# EAGLE design USGlasses (EAGLE 7.6.0)
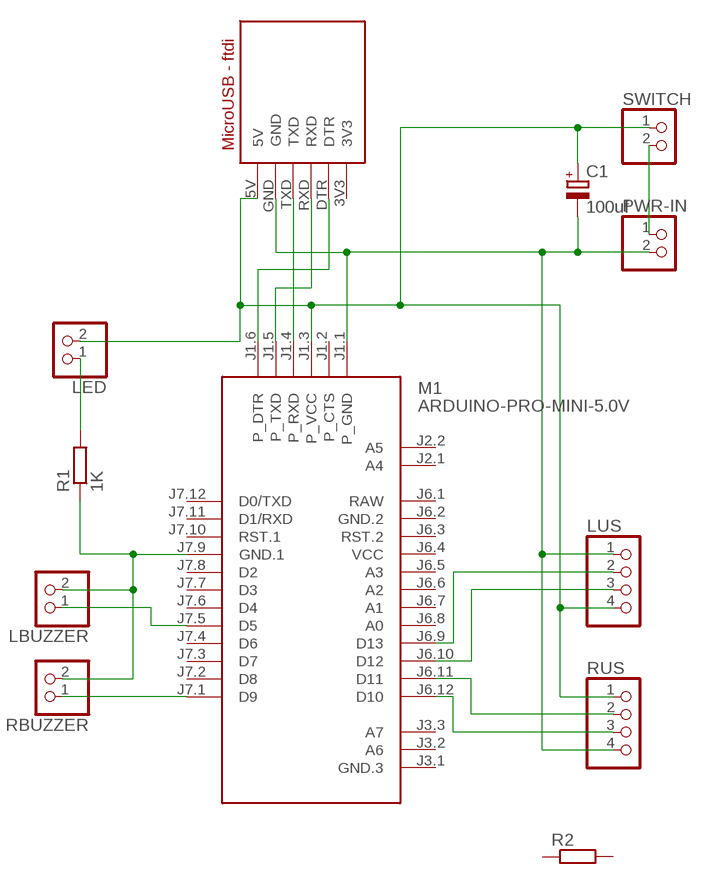
[diagram p0: schematic, sheet 1]

## Parts
C1  100uf  CPOL-EUE2,5-6E  [E2,5-6E]
LBUZZER  PINHD-1X2  [1X02]
LED  PINHD-1X2  [1X02]
LUS  PINHD-1X4  [1X04]
M1  ARDUINO-PRO-MINI-5.0V  [ARDUINO-PRO-MINI]
PWR-IN  PINHD-1X2  [1X02]
R1  1K  R-EU_0204/7  [0204/7]
R2  R-EU_0204/7  [0204/7]
RBUZZER  PINHD-1X2  [1X02]
RUS  PINHD-1X4  [1X04]
SWITCH  PINHD-1X2  [1X02]
U$1  MICRO-USB-DEV  [MICRO-USB-PAC]

## Nets
N$1: M1.J1.4(P_RXD) U$1.TXD
N$2: M1.J1.5(P_TXD) U$1.RXD
N$3: M1.J1.6(P_DTR) U$1.DTR
N$4: LED.1 R1.2
N$6: LUS.3 M1.J6.10(D12)
N$7: PWR-IN.1 SWITCH.2
N$9: C1.+ LED.2 LUS.4 M1.J1.3(P_VCC) RUS.1 SWITCH.1 U$1.5V
N$10: C1.- LUS.1 M1.J1.1(P_GND) PWR-IN.2 RUS.4 U$1.GND
N$11: LUS.2 M1.J6.9(D13)
N$12: M1.J6.11(D11) RUS.2
N$13: M1.J6.12(D10) RUS.3
N$14: LBUZZER.2 M1.J7.9(GND.1) R1.1 RBUZZER.2
N$15: M1.J7.1(D9) RBUZZER.1
N$16: LBUZZER.1 M1.J7.5(D5)
Unconnected: M1.J1.2(P_CTS) M1.J2.1(A4) M1.J2.2(A5) M1.J3.1(GND.3) M1.J3.2(A6) M1.J3.3(A7) M1.J6.3(RST.2) M1.J6.5(A3) M1.J6.6(A2) M1.J6.7(A1) M1.J6.8(A0) M1.J7.2(D8) M1.J7.3(D7) M1.J7.4(D6) M1.J7.6(D4) M1.J7.7(D3) M1.J7.8(D2) M1.J7.10(RST.1) M1.J7.11(D1/RXD) M1.J7.12(D0/TXD) R2.1 R2.2

## Power pins joined to a net without a drawn wire
3V3: U$1.3V3
GND.2: M1.J6.2(GND.2)
RAW: M1.J6.1(RAW)
VCC: M1.J6.4(VCC)

## Library data of the parts
C1 = resistor:CPOL-EU: POLARIZED CAPACITOR, European symbol
LBUZZER LED PWR-IN RBUZZER SWITCH = pinhead:PINHD-1X2: PIN HEADER
LUS RUS = pinhead:PINHD-1X4: PIN HEADER
M1 = diy-modules:ARDUINO-PRO-MINI-*: Arduino Pro Mini
R1 R2 = resistor:R-EU_: RESISTOR, European symbol
U$1 = Dr_Burrows_library:MICRO-USB-DEV: MicroUSB FTDI Programmer

## Board
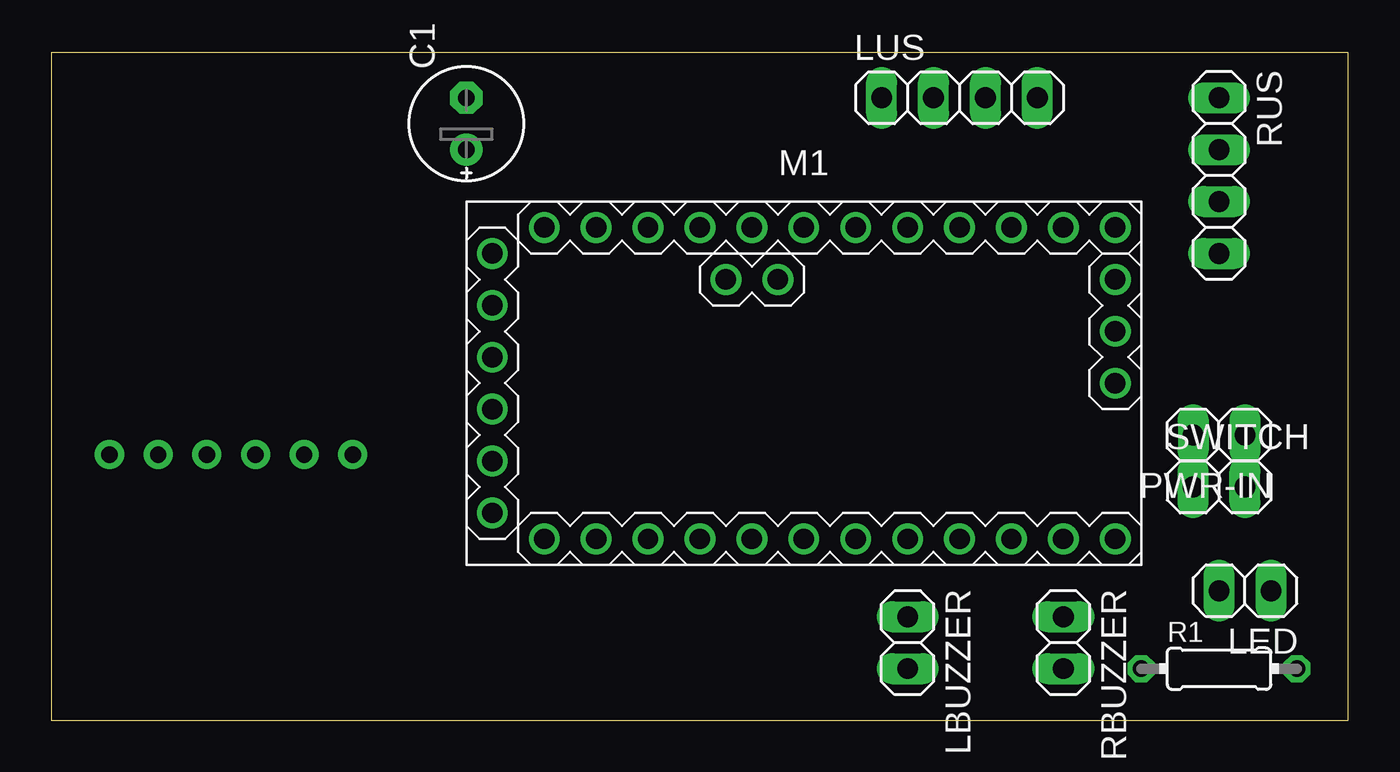
[diagram p1: board, top side]
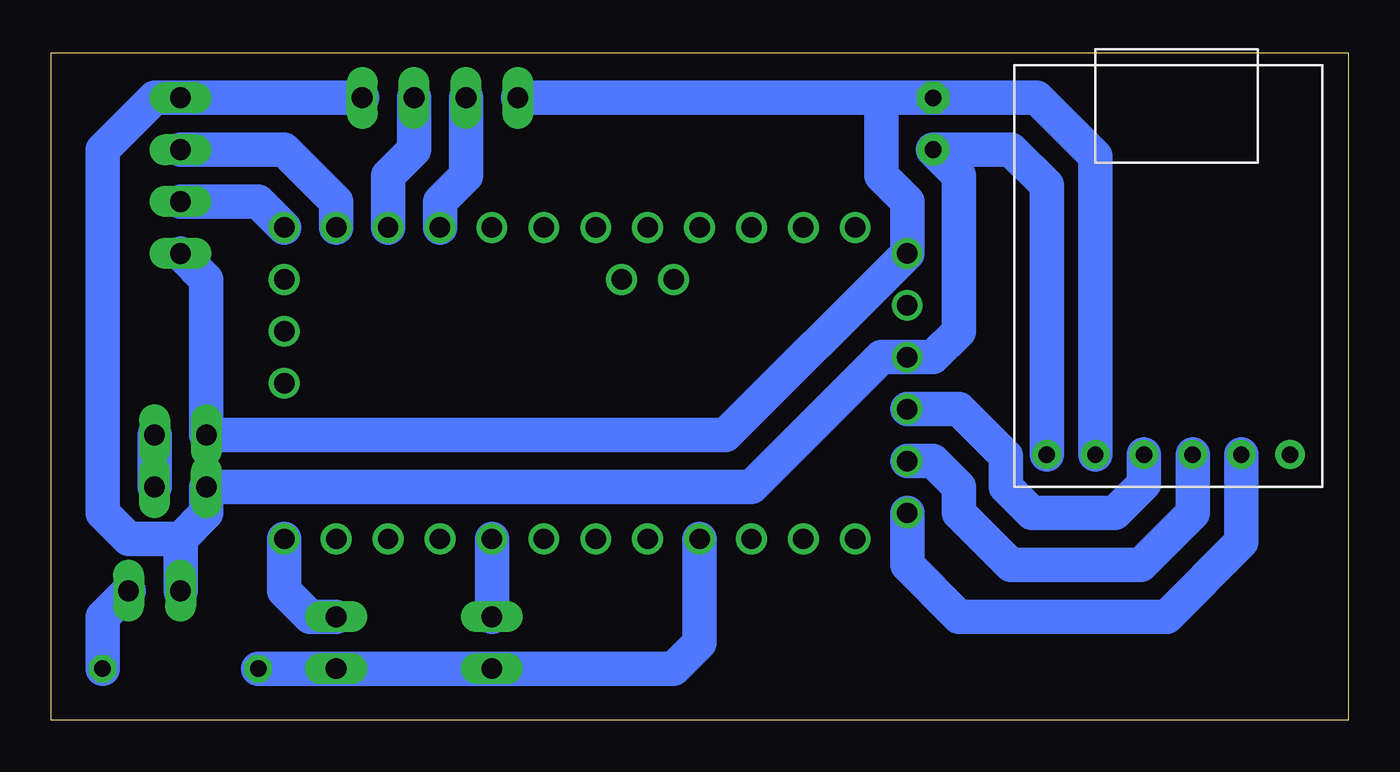
[diagram p2: board, bottom side, seen from below]

Size 63.48 x 32.69 mm. Coordinates in mm from the lower left corner, seen from the top.
Outline: 0,0 63.48,0 63.48,32.69 0,32.69 0,0
Copper layers (1*16): Top 0.035mm / dielectric 1.5mm / Bottom 0.035mm
Design rules "default *": minimum track width 10mil, minimum drill 24mil, track to track 8mil, track to pad 8mil, pad to pad 8mil, via to via 8mil, smd to smd 8mil, copper to edge 40mil, drill to drill 8mil, minimum pad ring 10mil, minimum via ring 8mil, stop-mask expansion 4mil, vias tented up to drill 0mil, thermal gap 10mil

### Footprints (pad centres in the part's own frame; a part is rotated, then mirrored left to right if it is on the bottom)
E2,5-6E = drill 0.813 pad 1.575: + -1.27,0 | drill 0.813 pad 1.575 octagon: - 1.27,0
1X02 = drill 1.016 long: 1 -1.27,0; 2 1.27,0
1X04 = drill 1.016 long: 1 -3.81,0; 2 -1.27,0; 3 1.27,0; 4 3.81,0
ARDUINO-PRO-MINI = drill 1: J1.1 -15.24,6.35; J1.2 -15.24,3.81; J1.3 -15.24,1.27; J1.4 -15.24,-1.27; J1.5 -15.24,-3.81; J1.6 -15.24,-6.35; J2.1 -1.27,5.08; J2.2 -3.81,5.08; J3.1 15.24,0; J3.2 15.24,2.54; J3.3 15.24,5.08; J6.1 -12.7,7.62; J6.2 -10.16,7.62; J6.3 -7.62,7.62; J6.4 -5.08,7.62; J6.5 -2.54,7.62; J6.6 0,7.62; J6.7 2.54,7.62; J6.8 5.08,7.62; J6.9 7.62,7.62; J6.10 10.16,7.62; J6.11 12.7,7.62; J6.12 15.24,7.62; J7.1 15.24,-7.62; J7.2 12.7,-7.62; J7.3 10.16,-7.62; J7.4 7.62,-7.62; J7.5 5.08,-7.62; J7.6 2.54,-7.62; J7.7 0,-7.62; J7.8 -2.54,-7.62; J7.9 -5.08,-7.62; J7.10 -7.62,-7.62; J7.11 -10.16,-7.62; J7.12 -12.7,-7.62
0204/7 = drill 0.813 octagon: 1 -3.81,0; 2 3.81,0
MICRO-USB-PAC = drill 0.8 pad 1.422: 3V3 1.587,1.587; 5V 1.587,13.494; DTR 1.587,3.969; GND 1.587,11.113; RXD 1.587,6.35; TXD 1.587,8.731

### Placement (x,y rotation side)
C1  20.32,29.21 90 top
LBUZZER  41.91,3.81 270 top
LED  58.42,6.35 180 top
LUS  44.45,30.48 0 top
M1  36.83,16.51 0 top
PWR-IN  57.15,13.97 180 top
R1  57.15,2.54 0 top
R2  -38.1,-12.7 0 top  (outside the outline)
RBUZZER  49.53,3.81 270 top
RUS  57.15,26.67 270 top
SWITCH  57.15,11.43 0 top
U$1  1.27,11.43 90 bottom

### Tracks (layer width: path | path; a pad name or v marks a point on that pad's centre or on a via)
N$1
  Bottom 1.676: U$1.TXD 10,11.59 11.43,10.16 15.49,10.16 16.76,11.43 16.76,12.95 19.05,15.24 M1.J1.4
N$2
  Bottom 1.676: U$1.RXD 7.62,10.16 10.16,7.62 16.51,7.62 19.05,10.16 19.05,11.43 20.32,12.7 M1.J1.5
N$3
  Bottom 1.676: U$1.DTR 5.24,8.73 8.89,5.08 19.05,5.08 21.59,7.62 M1.J1.6
N$4
  Bottom 1.676: LED.1 60.96,5.08 R1.2
N$6
  Bottom 1.676: M1.J6.10 46.99,26.67 45.72,27.94 LUS.3
N$7
  Bottom 1.676: SWITCH.2 PWR-IN.1
N$9
  Bottom 1.676: 57.15,8.89 59.69,8.89 60.96,10.16 60.96,27.94 58.42,30.48 RUS.1 LUS.4 | 57.15,8.89 55.88,10.16 SWITCH.1 29.21,11.43 22.86,17.78 M1.J1.3 20.32,17.78 19.05,19.05 19.05,26.67 C1.+ 16.51,27.94 14.76,26.19 U$1.5V | LED.2 57.15,8.89
N$10
  Bottom 1.676: RUS.4 55.88,21.59 PWR-IN.2 30.48,13.97 M1.J1.1 21.59,25.4 22.86,26.67 22.86,30.48 | 22.86,30.48 C1.- 15.24,30.48 12.38,27.62 U$1.GND | 22.86,30.48 LUS.1
N$11
  Bottom 1.676: M1.J6.9 44.45,25.4 43.18,26.67 LUS.2
N$12
  Bottom 1.676: RUS.2 52.07,27.94 49.53,25.4 M1.J6.11
N$13
  Bottom 1.676: RUS.3 53.34,25.4 M1.J6.12
N$14
  Bottom 1.676: M1.J7.9 31.75,3.81 33.02,2.54 LBUZZER.2 RBUZZER.2 R1.1
N$15
  Bottom 1.676: RBUZZER.1 50.8,5.08 52.07,6.35 M1.J7.1
N$16
  Bottom 1.676: LBUZZER.1 M1.J7.5